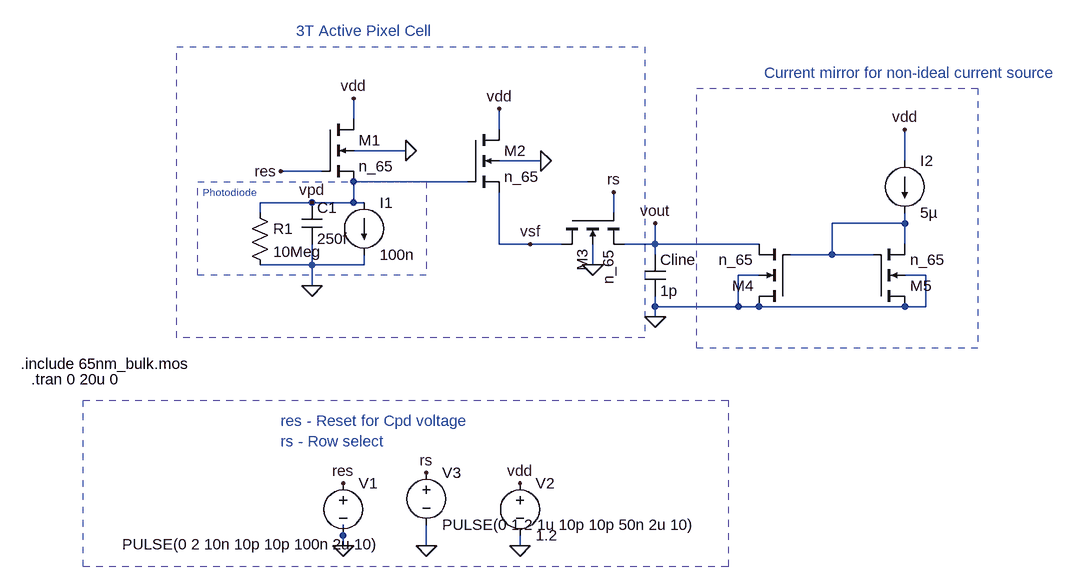
[diagram p0: schematic 3T_Pixel.asc]
3T_Pixel.asc, the LTspice schematic file:
Version 4.1
SHEET 1 1620 756
WIRE 160 64 160 32
WIRE 384 80 384 48
WIRE 240 112 160 112
WIRE 448 128 384 128
WIRE 1008 128 1008 80
WIRE 112 144 48 144
WIRE 336 160 160 160
WIRE 96 192 16 192
WIRE 160 192 160 160
WIRE 160 192 96 192
WIRE 176 192 160 192
WIRE 16 208 16 192
WIRE 560 208 560 176
WIRE 1008 224 1008 208
WIRE 1008 224 896 224
WIRE 384 256 384 176
WIRE 432 256 384 256
WIRE 480 256 432 256
WIRE 624 256 624 224
WIRE 624 256 576 256
WIRE 784 256 624 256
WIRE 1008 256 1008 224
WIRE 624 272 624 256
WIRE 896 272 896 224
WIRE 896 272 832 272
WIRE 960 272 896 272
WIRE 96 288 96 256
WIRE 96 288 16 288
WIRE 176 288 176 272
WIRE 176 288 96 288
WIRE 528 288 528 256
WIRE 784 304 752 304
WIRE 1040 304 1008 304
WIRE 96 320 96 288
WIRE 624 352 624 336
WIRE 752 352 752 304
WIRE 752 352 624 352
WIRE 784 352 752 352
WIRE 1008 352 784 352
WIRE 1040 352 1040 304
WIRE 1040 352 1008 352
WIRE 624 368 624 352
WIRE 144 704 144 688
WIRE 144 720 144 704
WIRE 272 720 272 688
WIRE 416 720 416 704
FLAG 144 720 0
FLAG 416 720 0
FLAG 144 624 res
FLAG 272 720 0
FLAG 272 608 rs
FLAG 416 624 vdd
FLAG 240 112 0
FLAG 160 32 vdd
FLAG 48 144 res
FLAG 96 320 0
FLAG 384 48 vdd
FLAG 448 128 0
FLAG 528 288 0
FLAG 560 176 rs
FLAG 624 368 0
FLAG 624 224 vout
FLAG 96 192 vpd
FLAG 432 256 vsf
FLAG 1008 80 vdd
SYMBOL voltage 144 608 R0
WINDOW 3 -340 110 Left 2
WINDOW 123 0 0 Left 0
WINDOW 39 0 0 Left 0
SYMATTR Value PULSE(0 2 10n 10p 10p 100n 2u 10)
SYMATTR InstName V1
SYMBOL voltage 272 592 R0
WINDOW 123 0 0 Left 0
WINDOW 39 0 0 Left 0
SYMATTR InstName V3
SYMATTR Value PULSE(0 1.2 1u 10p 10p 50n 2u 10)
SYMBOL voltage 416 608 R0
WINDOW 123 0 0 Left 0
WINDOW 39 0 0 Left 0
SYMATTR InstName V2
SYMATTR Value 1.2
SYMBOL nmos4 112 64 R0
SYMATTR InstName M1
SYMATTR Value n_65
SYMATTR Value2 l=1u w=1u
SYMBOL cap 80 192 R0
SYMATTR InstName C1
SYMATTR Value 250f
SYMBOL current 176 192 R0
WINDOW 123 0 0 Left 0
WINDOW 39 0 0 Left 0
SYMATTR InstName I1
SYMATTR Value 100n
SYMBOL nmos4 336 80 R0
SYMATTR InstName M2
SYMATTR Value n_65
SYMATTR Value2 l=65n w=0.5u
SYMBOL res 0 192 R0
SYMATTR InstName R1
SYMATTR Value 10Meg
SYMBOL nmos4 480 208 M90
SYMATTR InstName M3
SYMATTR Value n_65
SYMATTR Value2 l=65n w=0.5u
SYMBOL cap 608 272 R0
SYMATTR InstName Cline
SYMATTR Value 1p
SYMBOL nmos4 832 352 R180
SYMATTR InstName M4
SYMATTR Value n_65
SYMATTR Value2 l=65n w=2u
SYMBOL nmos4 960 352 M180
SYMATTR InstName M5
SYMATTR Value n_65
SYMATTR Value2 l=65n w=2u
SYMBOL current 1008 128 R0
WINDOW 123 0 0 Left 0
WINDOW 39 0 0 Left 0
SYMATTR InstName I2
SYMATTR Value 5µ
TEXT -352 440 Left 2 !.include 65nm_bulk.mos
TEXT 48 528 Left 2 ;res - Reset for Cpd voltage\nrs - Row select
TEXT -336 464 Left 2 !.tran 0 20u 0
TEXT 792 -8 Left 2 ;Current mirror for non-ideal current source
TEXT 72 -72 Left 2 ;3T Active Pixel Cell
TEXT -72 176 Left 1 ;Photodiode
RECTANGLE Normal 1120 416 688 16 2
RECTANGLE Normal 736 752 -256 496 2
RECTANGLE Normal 608 400 -112 -48 2
RECTANGLE Normal 272 304 -80 160 2

The netlist it stands for:
* 3T_Pixel.asc
V1 res 0 PULSE(0 2 10n 10p 10p 100n 2u 10)
V3 rs 0 PULSE(0 1.2 1u 10p 10p 50n 2u 10)
V2 vdd 0 1.2
M1 vdd res vpd 0 n_65 l=1u w=1u
C1 vpd 0 250f
I1 vpd 0 100n
M2 vdd vpd vsf 0 n_65 l=65n w=0.5u
R1 vpd 0 10Meg
M3 vsf rs vout 0 n_65 l=65n w=0.5u
Cline vout 0 1p
M4 0 N001 vout 0 n_65 l=65n w=2u
M5 0 N001 N001 0 n_65 l=65n w=2u
I2 vdd N001 5µ
.model NMOS NMOS
.model PMOS PMOS
.lib standard.mos
.include 65nm_bulk.mos
* res - Reset for Cpd voltage
* rs - Row select
.tran 0 20u 0
* Current mirror for non-ideal current source
* 3T Active Pixel Cell
* Photodiode
.backanno
.end